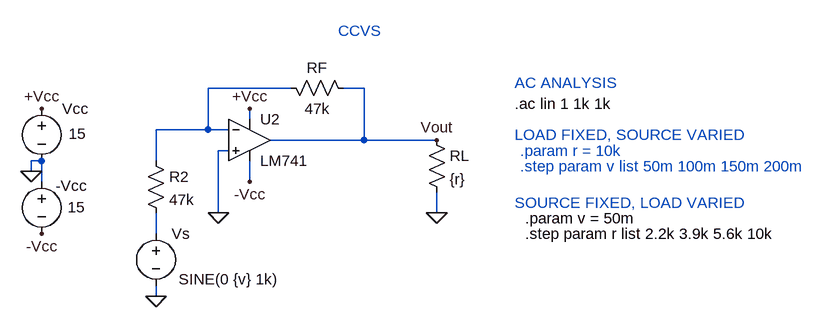
[diagram p0: schematic CCVS.asc]
CCVS.asc, the LTspice schematic file:
Version 4
SHEET 1 1220 680
WIRE 416 64 288 64
WIRE 528 64 496 64
WIRE 352 112 352 96
WIRE 288 128 288 64
WIRE 288 128 208 128
WIRE 320 128 288 128
WIRE 528 144 528 64
WIRE 528 144 384 144
WIRE 640 144 528 144
WIRE 320 160 304 160
WIRE 32 176 16 176
WIRE 208 176 208 128
WIRE 16 192 16 176
WIRE 32 208 32 176
WIRE 352 208 352 176
WIRE 304 256 304 160
WIRE 640 256 640 224
WIRE 208 288 208 256
WIRE 208 384 208 368
FLAG 16 192 0
FLAG 32 96 +Vcc
FLAG 32 288 -Vcc
FLAG 352 96 +Vcc
FLAG 352 208 -Vcc
FLAG 208 384 0
FLAG 640 256 0
FLAG 640 144 Vout
FLAG 304 256 0
SYMBOL voltage 208 272 R0
WINDOW 3 35 86 Left 2
WINDOW 39 0 0 Left 2
SYMATTR Value SINE(0 {v} 1k)
SYMATTR InstName Vs
SYMATTR Value2 AC {v} 0
SYMBOL voltage 32 80 R0
WINDOW 0 32 16 Left 2
WINDOW 3 42 54 Left 2
WINDOW 123 0 0 Left 2
WINDOW 39 135 -14 Left 2
SYMATTR InstName Vcc
SYMATTR Value 15
SYMBOL voltage 32 192 R0
WINDOW 0 22 22 Left 2
WINDOW 3 40 55 Left 2
WINDOW 123 0 0 Left 2
WINDOW 39 131 -86 Left 2
SYMATTR InstName -Vcc
SYMATTR Value 15
SYMBOL Opamps\\LM741 352 80 R0
SYMATTR InstName U2
SYMBOL res 624 128 R0
SYMATTR InstName RL
SYMATTR Value {r}
SYMBOL res 400 48 M90
WINDOW 0 0 56 VBottom 2
WINDOW 3 32 56 VTop 2
SYMATTR InstName RF
SYMATTR Value 47k
SYMBOL res 192 160 R0
SYMATTR InstName R2
SYMATTR Value 47k
TEXT 760 88 Left 2 !.ac lin 1 1k 1k
TEXT 776 264 Left 2 !.param v = 50m
TEXT 768 160 Left 2 ;.param r = 10k
TEXT 776 288 Left 2 !.step param r list 2.2k 3.9k 5.6k 10k
TEXT 768 184 Left 2 ;.step param v list 50m 100m 150m 200m
TEXT 488 -24 Left 2 ;CCVS
TEXT 760 56 Left 2 ;AC ANALYSIS
TEXT 760 240 Left 2 ;SOURCE FIXED, LOAD VARIED
TEXT 760 136 Left 2 ;LOAD FIXED, SOURCE VARIED

The netlist it stands for:
* CCVS.asc
Vs N002 0 SINE(0 {v} 1k) AC {v} 0
Vcc +Vcc 0 15
V§-Vcc 0 -Vcc 15
XU2 0 N001 +Vcc -Vcc Vout LM741  ; pins In+ In- V+ V- OUT
RL Vout 0 {r}
RF N001 Vout 47k
R2 N001 N002 47k
.ac lin 1 1k 1k
.param v = 50m
* .param r = 10k
.step param r list 2.2k 3.9k 5.6k 10k
* .step param v list 50m 100m 150m 200m
* CCVS
* AC ANALYSIS
* SOURCE FIXED, LOAD VARIED
* LOAD FIXED, SOURCE VARIED
.lib LM741.lib
.backanno
.end